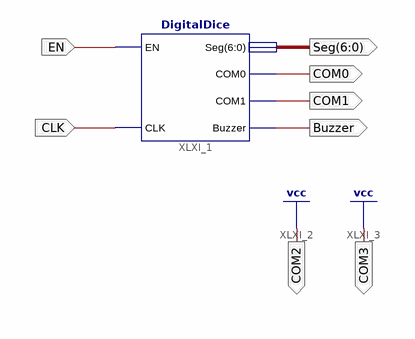
[diagram p0: schematic sheet 1]
// Xilinx ISE schematic main.sch (spartan6) as structural Verilog: 1 symbols, 8 ports
module main (
  input  EN,
  input  CLK,
  output COM0,
  output COM1,
  output [6:0] Seg,
  output Buzzer,
  output COM2,
  output COM3
);

  DigitalDice XLXI_1 (.EN(EN), .CLK(CLK), .COM0(COM0), .COM1(COM1), .Seg(Seg), .Buzzer(Buzzer));

  assign COM2 = 1'b1;
  assign COM3 = 1'b1;

  // Notes on the sheet:
  //   LOC on signal EN = P47
  //   LOC on signal CLK = P123
  //   LOC on signal COM0 = P44
  //   LOC on signal COM1 = P43
  //   LOC on signal Seg(6:0) = P27,P29,P32,P34,P35,P40,P41
  //   LOC on signal Buzzer = P83
  //   LOC on signal COM2 = P33
  //   LOC on signal COM3 = P30
endmodule
